# Altium schematic sheet battery_lcl-charging.SchDoc: Battery Charger - LCL
size A4; Date: 2015-09-21; Author: Piotr Kuligowski; DocumentNumber: 1; Revision: 1-0; SheetNumber: 1; SheetTotal: 14; Model: EM1
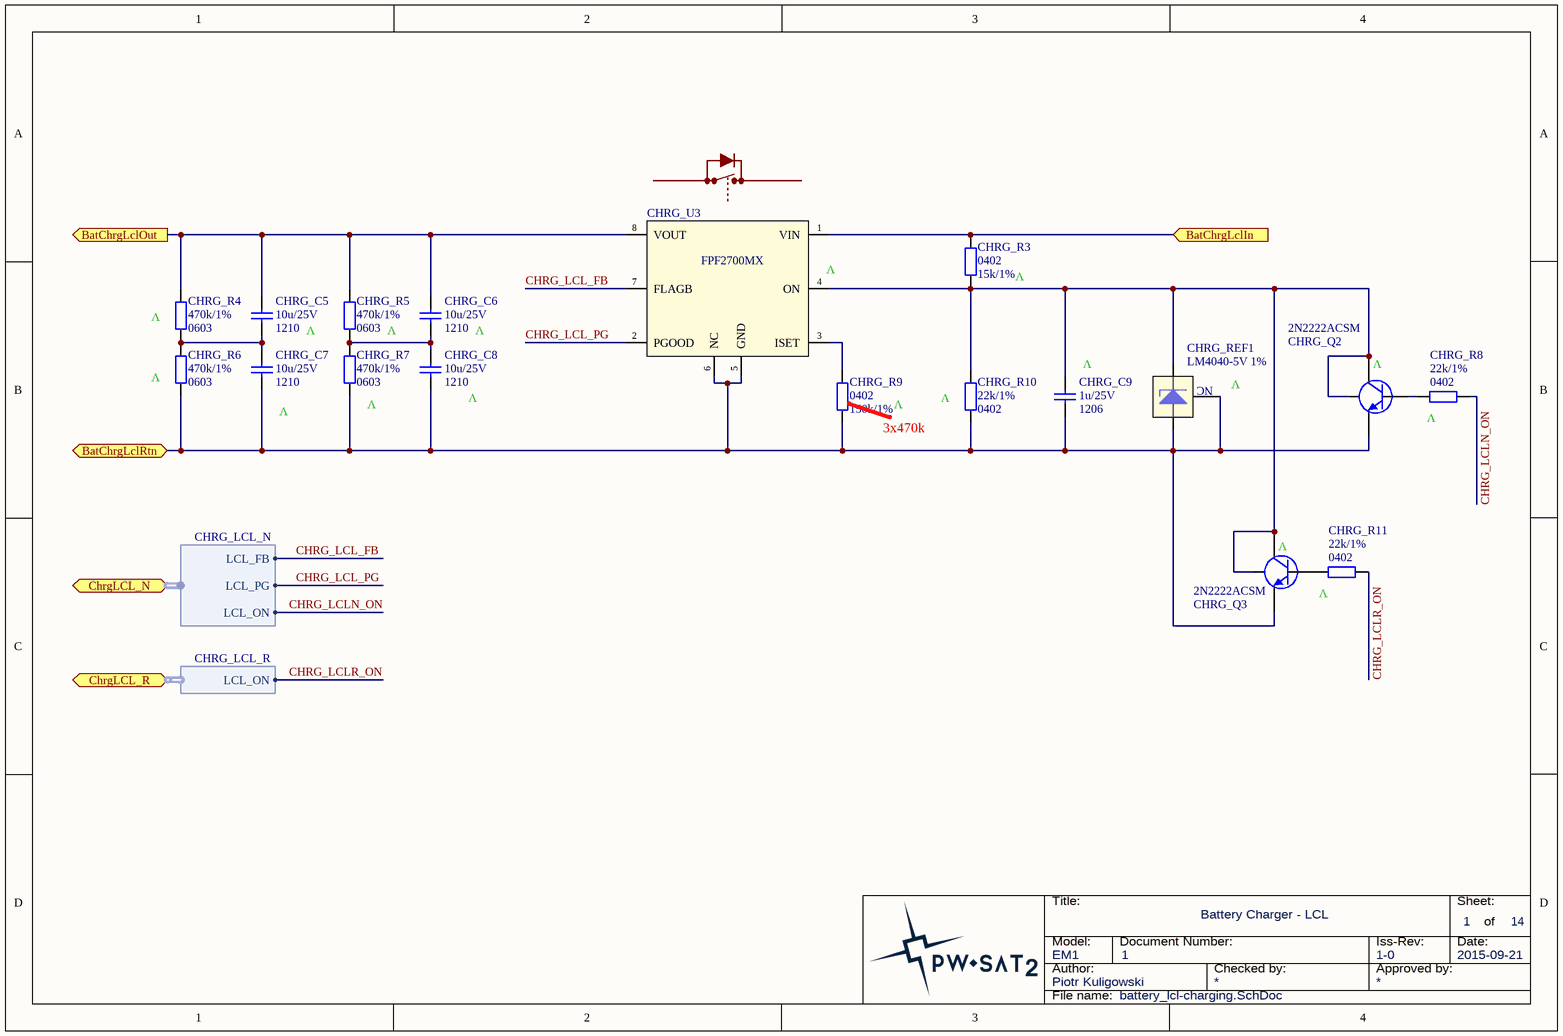
[diagram p0: battery_lcl-charging.SchDoc]

## Parts
CHRG_C5  Package: 1210  [SMD_Capacitor_1210]  (hidden comment: 10u/25V)
CHRG_C6  Package: 1210  [SMD_Capacitor_1210]  (hidden comment: 10u/25V)
CHRG_C7  Package: 1210  [SMD_Capacitor_1210]  (hidden comment: 10u/25V)
CHRG_C8  Package: 1210  [SMD_Capacitor_1210]  (hidden comment: 10u/25V)
CHRG_C9  Package: 1206  [SMD_Capacitor_1206]  (hidden comment: 1u/25V)
CHRG_Q2  2N2222ACSM  [LCC1-4_BEC]
CHRG_Q3  2N2222ACSM  [LCC1-4_BEC]
CHRG_R3  Package: 0402  [SMD_Resistor_0402]  (hidden comment: 15k/1%)
CHRG_R4  Package: 0603  [SMD_Resistor_0603]  (hidden comment: 470k/1%)
CHRG_R5  Package: 0603  [SMD_Resistor_0603]  (hidden comment: 470k/1%)
CHRG_R6  Package: 0603  [SMD_Resistor_0603]  (hidden comment: 470k/1%)
CHRG_R7  Package: 0603  [SMD_Resistor_0603]  (hidden comment: 470k/1%)
CHRG_R8  Package: 0402  [SMD_Resistor_0402]  (hidden comment: 22k/1%)
CHRG_R9  Package: 0402  [SMD_Resistor_0402]  (hidden comment: 150k/1%)
CHRG_R10  Package: 0402  [SMD_Resistor_0402]  (hidden comment: 22k/1%)
CHRG_R11  Package: 0402  [SMD_Resistor_0402]  (hidden comment: 22k/1%)
CHRG_REF1  LM4040-5V 1%  [SOT23-3]
CHRG_U3  FPF2700MX  [SOIC-8-N]

## Ports
BatChrgLclIn (in), BatChrgLclOut (out), BatChrgLclRtn, ChrgLCL_N (harness CHRG_LCL_N), ChrgLCL_R (harness CHRG_LCL_R)

## Harnesses
CHRG_LCL_N: LCL_FB, LCL_PG, LCL_ON
CHRG_LCL_R: LCL_ON

## Nets
BatChrgLclIn: CHRG_R3.1 CHRG_U3.1(VIN) ; port BatChrgLclIn
BatChrgLclOut: CHRG_C5.1 CHRG_C6.1 CHRG_R4.1 CHRG_R5.1 CHRG_U3.8(VOUT) ; port BatChrgLclOut
BatChrgLclRtn: CHRG_C7.2 CHRG_C8.2 CHRG_C9.2 CHRG_Q2.E CHRG_Q3.E CHRG_R6.2 CHRG_R7.2 CHRG_R9.2 CHRG_R10.2 CHRG_REF1.2(A) CHRG_REF1.3(NC) CHRG_U3.5(GND) CHRG_U3.6(NC) ; port BatChrgLclRtn
CHRG_LCL_FB: CHRG_U3.7(FLAGB) ; port ChrgLCL_N.LCL_FB
CHRG_LCL_PG: CHRG_U3.2(PGOOD) ; port ChrgLCL_N.LCL_PG
CHRG_LCLN_ON: CHRG_R8.2 ; port ChrgLCL_N.LCL_ON
CHRG_LCLR_ON: CHRG_R11.2 ; port ChrgLCL_R.LCL_ON
NetCHRG_C5_2: CHRG_C5.2 CHRG_C7.1 CHRG_R4.2 CHRG_R6.1
NetCHRG_C6_2: CHRG_C6.2 CHRG_C8.1 CHRG_R5.2 CHRG_R7.1
NetCHRG_C9_1: CHRG_C9.1 CHRG_Q2.C CHRG_Q2.Shield CHRG_Q3.C CHRG_Q3.Shield CHRG_R3.2 CHRG_R10.1 CHRG_REF1.1(K) CHRG_U3.4(ON)
NetCHRG_Q2_B: CHRG_Q2.B CHRG_R8.1
NetCHRG_Q3_B: CHRG_Q3.B CHRG_R11.1
NetCHRG_R9_1: CHRG_R9.1 CHRG_U3.3(ISET)

## Notes on the sheet
- (near CHRG_R4) V
- (near CHRG_U3) V
- V
- (near CHRG_R6) V
- (near CHRG_C8) V
- (near CHRG_R10) V
- (near CHRG_C9) V
- (near CHRG_REF1) V
- (near CHRG_Q2) V
- (near CHRG_R7) V
- 3x470k
- (near CHRG_R8) V
- (near CHRG_Q3) V
- (near CHRG_R11) V
- Title:
- Sheet:
- of
- Author:
- Model:
- Document Number:
- Checked by:
- Iss-Rev:
- Approved by:
- Date:
- File name:

## Library data of the parts
CHRG_C5-CHRG_C8 = Cer_GCJ32ER71E106KA12L: Ceramic Cap Murata Automotive 10u/25V X7R 1210; Manufacturer: Murata; ManufacturerPartNumber: GCJ32ER71E106KA12L; Value: 10u/25V
CHRG_C9 = Cer_C1206T105K3RALTU: Ceramic Cap Kemet COTS 1u/25V X7R 1206; ManufacturerPartNumber: C1206T105K3RALTU; Manufacturer: Kemet; Value: 1u/25V
CHRG_Q2 CHRG_Q3 = 2N2222ACSM: Silicon Planar Epitaxial NPN Transistor.; Manufacturer: Semelab-TT; Value: 2N2222ACSM
CHRG_R3 = CRCW040215K0FKxxxx: 15k/1% Vishay CRCW 0402 Resistor. 63mW, 100ppm, 50V.; Manufacturer: Vishay; ManufacturerPartNumber: CRCW040215K0FKxxxx; Value: 15k/1%
CHRG_R4-CHRG_R7 = CRCW0603470KFKxxxx: 470k/1% Vishay CRCW 0603 Resistor. 100mW, 100ppm, 75V.; Manufacturer: Vishay; ManufacturerPartNumber: CRCW0603470KFKxxxx; Value: 470k/1%
CHRG_R8 CHRG_R10 CHRG_R11 = CRCW040222K0FKxxxx: 22k/1% Vishay CRCW 0402 Resistor. 63mW, 100ppm, 50V.; Manufacturer: Vishay; ManufacturerPartNumber: CRCW040222K0FKxxxx; Value: 22k/1%
CHRG_R9 = CRCW0402150KFKxxxx: 150k/1% Vishay CRCW 0402 Resistor. 63mW, 100ppm, 50V.; Manufacturer: Vishay; ManufacturerPartNumber: CRCW0402150KFKxxxx; Value: 150k/1%
CHRG_REF1 = LM4040DIM3-5.0: Shunt V-REF, 5V, 1%, SOT23-3; Manufacturer: Texas Instruments; ManufacturerPartNumber: LM4040DIM3-5.0; Value: LM4040-5V 1%
CHRG_U3 = FPF2700MX: Adj over-current protection 0.4-2A, Load Switch; Manufacturer: Fairchild Semiconductor; Value: FPF2700MX